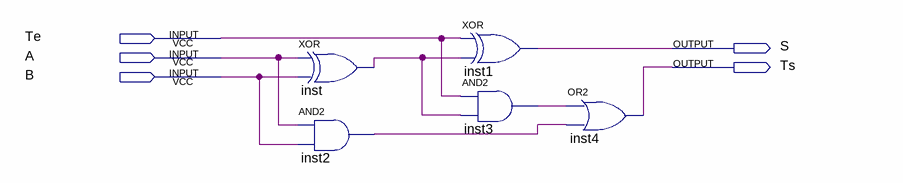
[diagram p0: schematic sheet]
// Quartus schematic somadorcompleto.bdf as structural Verilog: 5 symbols, 5 pins
module somadorcompleto (
  input  Te,
  input  A,
  input  B,
  output S,
  output Ts
);

  wire inst2_out, inst3_out, inst_out;

  xor inst (inst_out, A, B);
  and inst2 (inst2_out, A, B);
  xor inst1 (S, Te, inst_out);
  and inst3 (inst3_out, Te, inst_out);
  or inst4 (Ts, inst3_out, inst2_out);
endmodule
